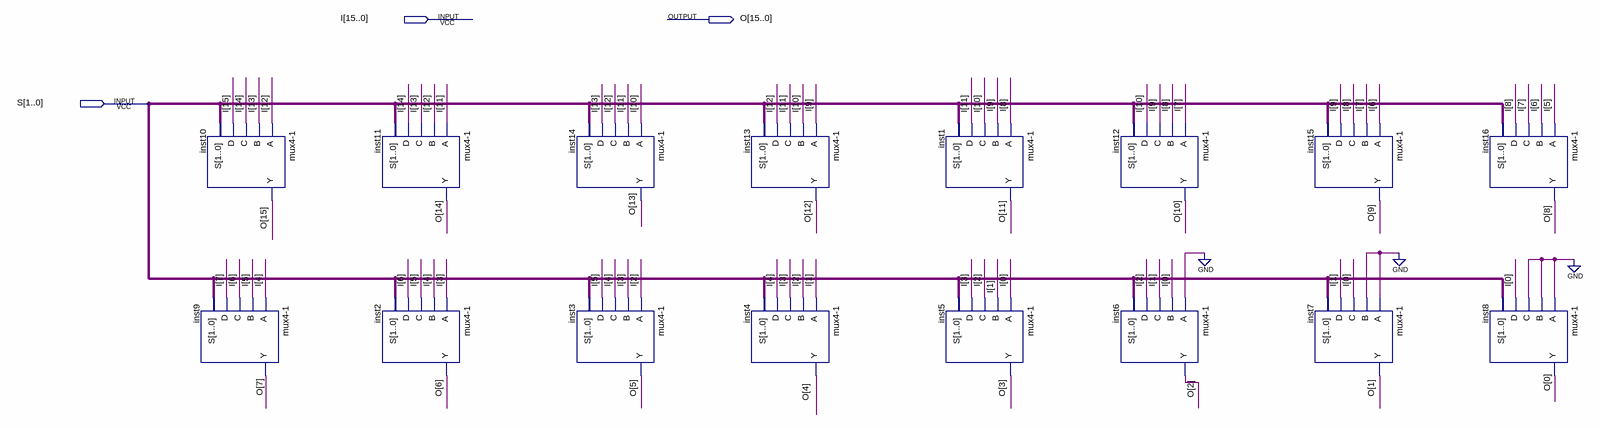
[diagram p0: schematic sheet]
// Quartus schematic shift_left.bdf as structural Verilog: 16 symbols, 3 pins
module shift_left (
  input  [15:0] I,
  input  [1:0] S,
  output [15:0] O
);

  \mux4-1  inst10 (.A(I[12]), .B(I[13]), .C(I[14]), .D(I[15]), .S(S), .Y(O[15]));
  \mux4-1  inst9 (.A(I[4]), .B(I[5]), .C(I[6]), .D(I[7]), .S(S), .Y(O[7]));
  \mux4-1  inst11 (.A(I[11]), .B(I[12]), .C(I[13]), .D(I[14]), .S(S), .Y(O[14]));
  \mux4-1  inst2 (.A(I[3]), .B(I[4]), .C(I[5]), .D(I[6]), .S(S), .Y(O[6]));
  \mux4-1  inst14 (.A(I[10]), .B(I[11]), .C(I[12]), .D(I[13]), .S(S), .Y(O[13]));
  \mux4-1  inst3 (.A(I[2]), .B(I[3]), .C(I[4]), .D(I[5]), .S(S), .Y(O[5]));
  \mux4-1  inst13 (.A(I[9]), .B(I[10]), .C(I[11]), .D(I[12]), .S(S), .Y(O[12]));
  \mux4-1  inst4 (.A(I[1]), .B(I[2]), .C(I[3]), .D(I[4]), .S(S), .Y(O[4]));
  \mux4-1  inst1 (.A(I[8]), .B(I[9]), .C(I[10]), .D(I[11]), .S(S), .Y(O[11]));
  \mux4-1  inst5 (.A(I[0]), .B(I[1]), .C(I[2]), .D(I[3]), .S(S), .Y(O[3]));
  \mux4-1  inst12 (.A(I[7]), .B(I[8]), .C(I[9]), .D(I[10]), .S(S), .Y(O[10]));
  \mux4-1  inst6 (.A(1'b0), .B(I[0]), .C(I[1]), .D(I[2]), .S(S), .Y(O[2]));
  \mux4-1  inst15 (.A(I[6]), .B(I[7]), .C(I[8]), .D(I[9]), .S(S), .Y(O[9]));
  \mux4-1  inst7 (.A(1'b0), .B(1'b0), .C(I[0]), .D(I[1]), .S(S), .Y(O[1]));
  \mux4-1  inst16 (.A(I[5]), .B(I[6]), .C(I[7]), .D(I[8]), .S(S), .Y(O[8]));
  \mux4-1  inst8 (.A(1'b0), .B(1'b0), .C(1'b0), .D(I[0]), .S(S), .Y(O[0]));
endmodule
